# Altium schematic sheet Kit STM32.SchDoc
size A
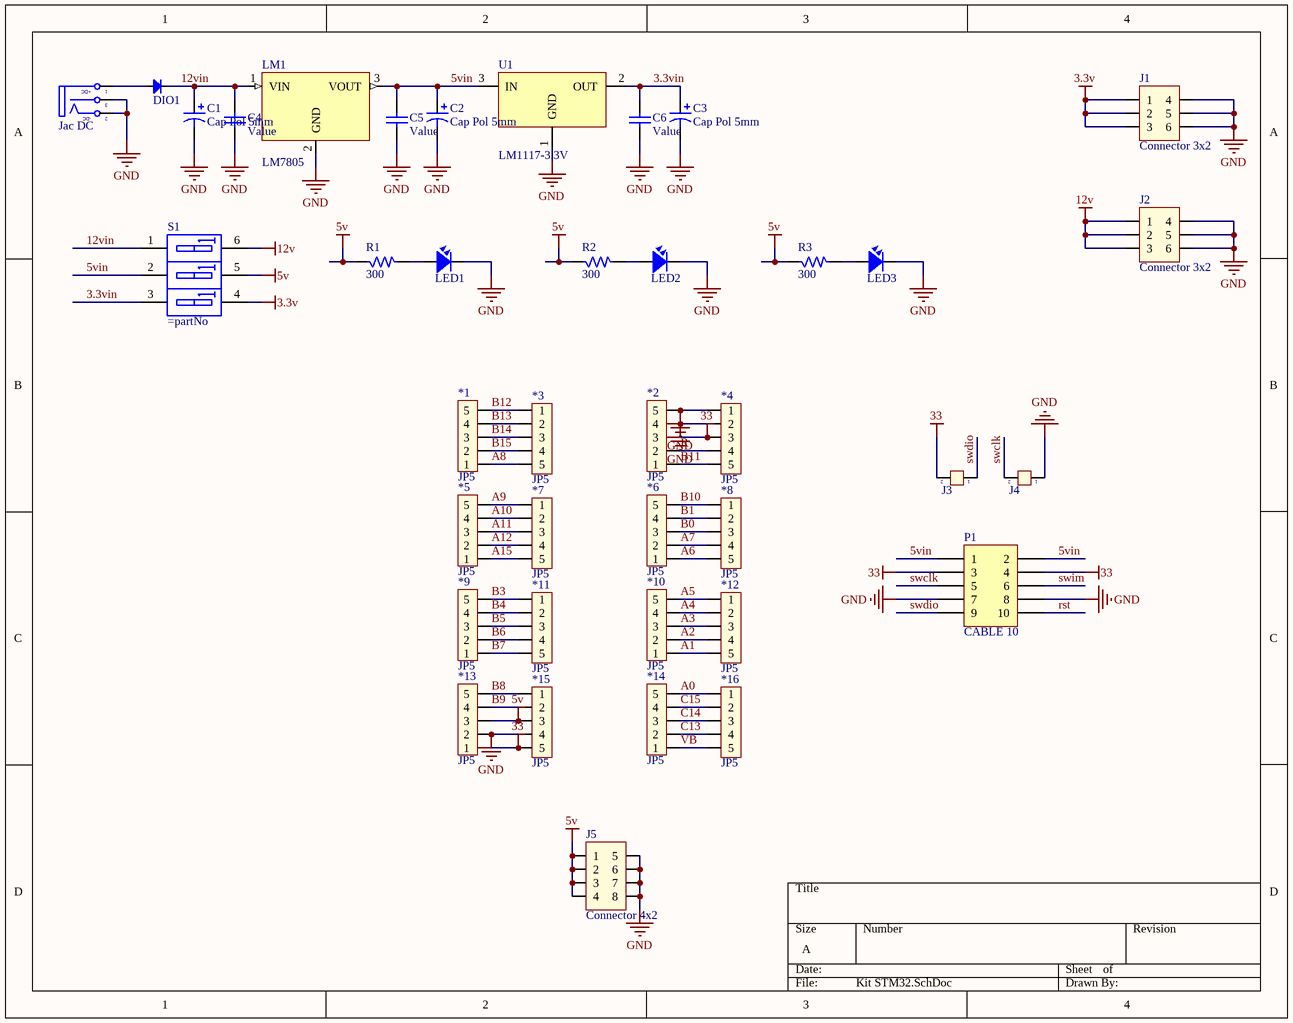
[diagram p0: Kit STM32.SchDoc]

## Parts
*1  JP5  [JP5]
*2  JP5  [JP5]
*3  JP5  [JP5]
*4  JP5  [JP5]
*5  JP5  [JP5]
*6  JP5  [JP5]
*7  JP5  [JP5]
*8  JP5  [JP5]
*9  JP5  [JP5]
*10  JP5  [JP5]
*11  JP5  [JP5]
*12  JP5  [JP5]
*13  JP5  [JP5]
*14  JP5  [JP5]
*15  JP5  [JP5]
*16  JP5  [JP5]
C1  Cap Pol 5mm  [C5mm]
C2  Cap Pol 5mm  [C5mm]
C3  Cap Pol 5mm  [C5mm]
C4  Value  [C1206]
C5  Value  [C1206]
C6  Value  [C1206]
DIO1  Diode SMD  [DIO-SMD-106]  (value not drawn)
J1  Connector 3x2  [JP3x2]
J2  Connector 3x2  [JP3x2]
J3  Jumper 2  [JP2]  (value not drawn)
J4  Jumper 2  [JP2]  (value not drawn)
J5  Connector 4x2  [JP4x2]
JDC1  Jac DC  [DC-IN]
LED1  LED  [LED 3512]  (value not drawn)
LED2  LED  [LED 3512]  (value not drawn)
LED3  LED  [LED 3512]  (value not drawn)
LM1  LM7805  [QTO-220H3]
P1  CABLE 10  [CABLE 10]
R1  300  [SM-1206]
R2  300  [SM-1206]
R3  300  [SM-1206]
S1  (no value)  [SW-DIP3]
U1  LM1117-3.3V  [SOT223-4N]

## Nets
3.3v: J1.1 J1.2 J1.3 S1.4
5v: *13.3 *15.3 J5.1 J5.2 J5.3 J5.4 R1.1 R2.1 R3.1 S1.5
12v: J2.1 J2.2 J2.3 S1.6
33: *2.3 *4.3 *13.1 *15.5 J3.2 P1.3 P1.4
GND: *2.4 *2.5 *4.1 *4.2 *13.2 *15.4 C1.2 C2.2 C3.2 C4.1 C5.1 C6.1 J1.4 J1.5 J1.6 J2.4 J2.5 J2.6 J4.1 J5.5 J5.6 J5.7 J5.8 JDC1.2(TN) JDC1.3(S) LED1.2 LED2.2 LED3.2 LM1.2(GND) P1.7 P1.8 U1.1(GND)
3.3vin: C3.1 C6.2 S1.3 U1.2(OUT)
5vin: C2.1 C5.2 LM1.3(VOUT) P1.1 P1.2 S1.2 U1.3(IN)
12vin: C1.1 C4.2 DIO1.2(K) LM1.1(VIN) S1.1
A0: *14.5 *16.1
A1: *10.1 *12.5
A2: *10.2 *12.4
A3: *10.3 *12.3
A4: *10.4 *12.2
A5: *10.5 *12.1
A6: *6.1 *8.5
A7: *6.2 *8.4
A8: *1.1 *3.5
A9: *5.5 *7.1
A10: *5.4 *7.2
A11: *5.3 *7.3
A12: *5.2 *7.4
A15: *5.1 *7.5
B0: *6.3 *8.3
B1: *6.4 *8.2
B3: *9.5 *11.1
B4: *9.4 *11.2
B5: *9.3 *11.3
B6: *9.2 *11.4
B7: *9.1 *11.5
B8: *13.5 *15.1
B9: *13.4 *15.2
B10: *6.5 *8.1
B11: *2.1 *4.5
B12: *1.5 *3.1
B13: *1.4 *3.2
B14: *1.3 *3.3
B15: *1.2 *3.4
C13: *14.2 *16.4
C14: *14.3 *16.3
C15: *14.4 *16.2
R: *2.2 *4.4
rst: P1.10
swclk: J4.2 P1.5
swdio: J3.1 P1.9
swim: P1.6
VB: *14.1 *16.5
NetDIO1_1: DIO1.1(A) JDC1.1(T)
NetLED1_1: LED1.1 R1.2
NetLED2_1: LED2.1 R2.2
NetLED3_1: LED3.1 R3.2

## Notes on the sheet
- (in symbol DCIN) +DC; -DC

## Library data of the parts
C1-C3 = Cap Pol 5mm: Polarized Capacitor (Axial); Published: 8-Jun-2000; LatestRevisionDate: 17-Jul-2002; LatestRevisionNote: Re-released for DXP Platform.; PackageReference: POLAR0.8; Publisher: Altium Limited
C4-C6 = Cap SMD 1206
DIO1 = Diode SMD: Default Diode; Code - JEDEC: DO-214-AB; Value: 1N5007; Published: 8-Jun-2000; Revision: July-2002: Re-released for DXP Platform.; Publisher: Altium Limited
J1 J2 = JP3x2: Value: Connector 3x2
J3 J4 = JP 2: Value: JP 2
J5 = JP4x2: Value: Connector 4x2
JDC1 = DCIN: Jac DC input; Value: Jac DC
LED1-LED3 = LED SMD: Value: LED 3 - 5 ly 2 Colour
LM1 = LM7805: TO-220; Text Field1: 70; Text Field2: 30
P1 = CABLE 10: Header, 5-Pin, Dual row; LatestRevisionDate: 17-Jul-2002; LatestRevisionNote: Re-released for DXP Platform.; Publisher: Altium Limited
R1-R3 = Res: Resistor 1/4W; Value: R1/4W - 1K
S1 = SWDIP3: WS-DITV 2.54 mm small compact THT flat actuator with top tape; Manufacturer: Wurth Elektronik; Part No.: 418127160901; ComponentLink1 Description: Manufacturer; ComponentLink2 Description: Datasheet; Pole: 01; Created Date: Dec.2015; ComponentLink1URL: http://www.we-online.com; ComponentLink2URL: http://katalog.we-online.de/em/datasheet/4181271609xx.pdf; Created by: Baojun Chen
U1 = LM1117: 800mA Low-Dropout Linear Regulator; Creator: Nguyen Ba Bien; Website: http://group3i.net